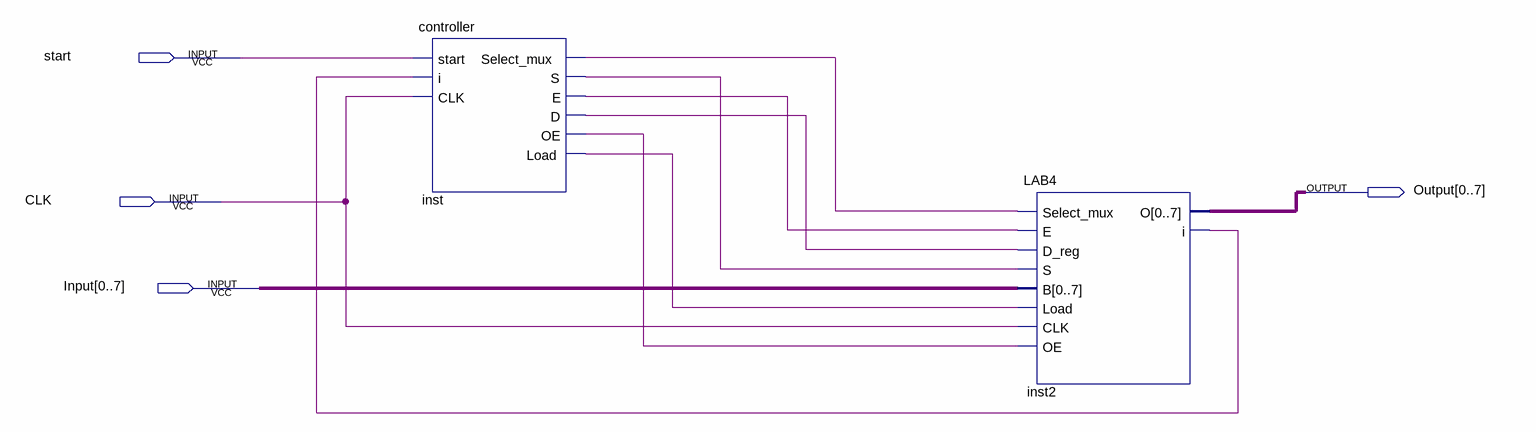
[diagram p0: schematic sheet]
// Quartus schematic schemetic.bdf as structural Verilog: 2 symbols, 4 pins
module schemetic (
  input  start,
  input  CLK,
  input  [0:7] Input,
  output [0:7] Output
);

  wire inst2_i, inst_d, inst_e, inst_load, inst_oe, inst_s, inst_select_mux;

  controller inst (
    .start(start), .i(inst2_i), .CLK(CLK), .Select_mux(inst_select_mux), .S(inst_s), .E(inst_e), .D(inst_d),
    .OE(inst_oe), .Load(inst_load));
  LAB4 inst2 (
    .Select_mux(inst_select_mux), .E(inst_e), .D_reg(inst_d), .S(inst_s), .B(Input), .Load(inst_load),
    .CLK(CLK), .OE(inst_oe), .O(Output), .i(inst2_i));
endmodule
